# Altium project SmartDice-3rd.PrjPcb
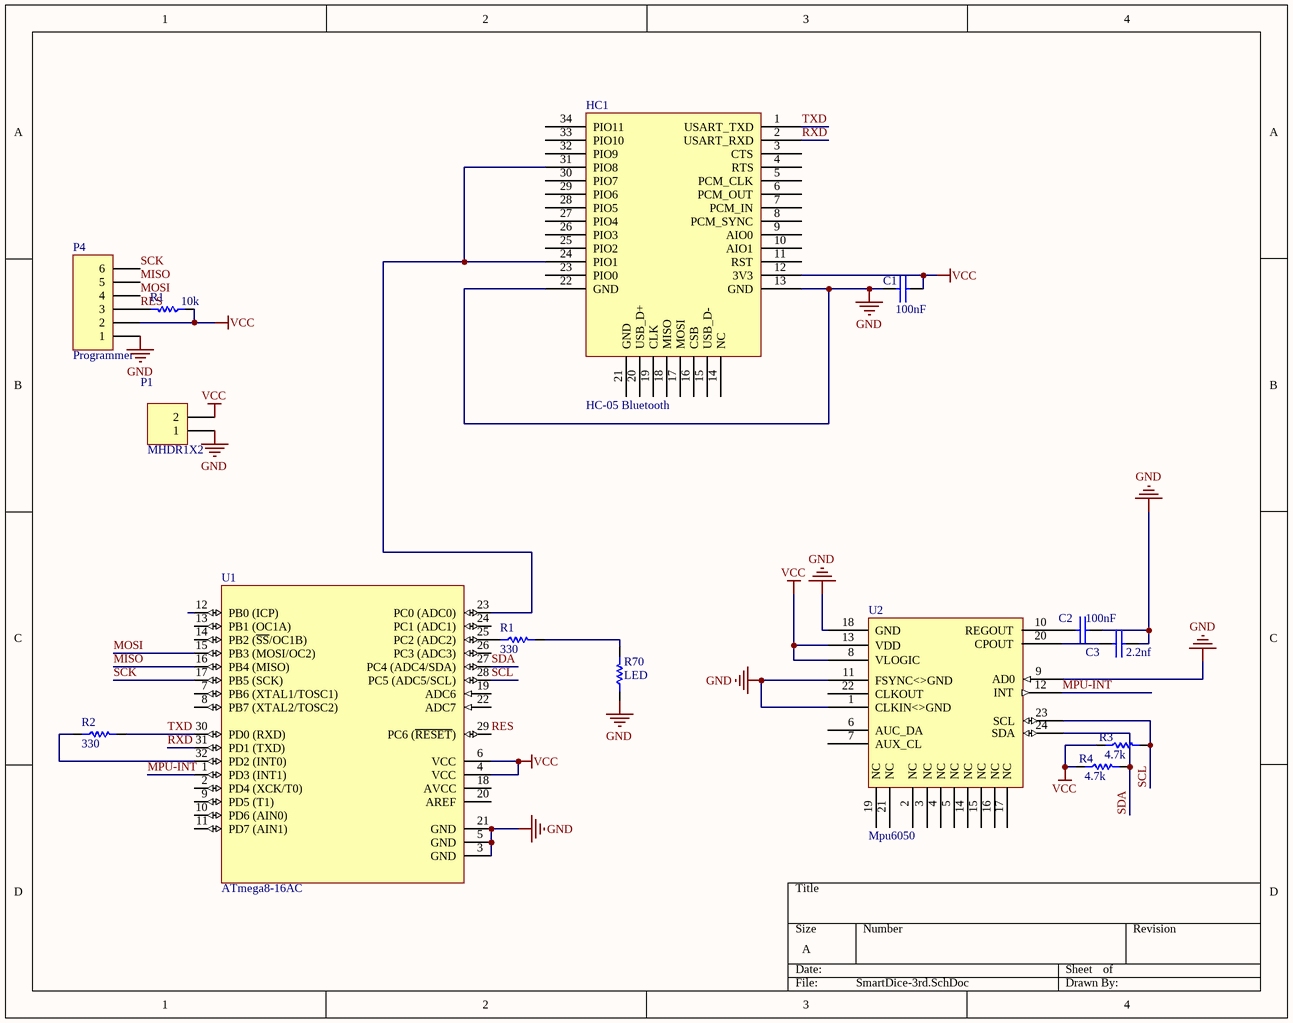
[diagram p0: SmartDice-3rd.SchDoc]
1 sheet, 14 parts. Net scope: global (net labels, ports and power ports of the same name join across sheets).
Board file: SmartDice-3rd.PcbDoc

## Sheet SmartDice-3rd.SchDoc
size A

### Parts
(Parts that share a designator on the sheet are numbered #1, #2 ... from top to bottom, then left to right.)
C1  100nF  [SMD_CAP_0805]
C2  100nF  [SMD_CAP_0805]
C3  2.2nf  [SMD_CAP_1206]
HC1  HC-05 Bluetooth  [HC-05]
P1  MHDR1X2  [MHDR1X2]
P4  Programmer  [MHDR1X6]
R1#1  10k  [RES 0603 (1608X06L)]
R1#2  330  [RES 0603 (1608X06L)]
R2  330  [RES 0603 (1608X06L)]
R3  4.7k  [RES 0603 (1608X06L)]
R4  4.7k  [RES 0603 (1608X06L)]
R70  LED  [RES 0603 (1608X06L)]
U1  ATmega8-16AC  [32A_N]
U2  Mpu6050  [Mpu6050]

### Nets
GND: C1.1(+) C2.2(-) C3.2(-) HC1.13(GND) HC1.22(GND) P1.1 P4.1 R70.1 U1.3(GND) U1.5(GND) U1.21(GND) U2.1(CLKIN<>GND) U2.9(AD0) U2.11(FSYNC<>GND) U2.18(GND)
VCC: C1.2(-) HC1.12(3V3) P1.2 P4.2 R1#1.1 R3.1 R4.1 U1.4(VCC) U1.6(VCC) U2.8(VLOGIC) U2.13(VDD)
MISO: P4.5 U1.16(PB4_(MISO))
MOSI: P4.4 U1.15(PB3_(MOSI/OC2))
MPU-INT: U1.1(PD3_(INT1)) U2.12(INT)
RES: P4.3 R1#1.2 U1.29(PC6_(~{RESET}))
RXD: HC1.2(USART_RXD) U1.31(PD1_(TXD))
SCK: P4.6 U1.17(PB5_(SCK))
SCL: R3.2 U1.28(PC5_(ADC5/SCL)) U2.23(SCL)
SDA: R4.2 U1.27(PC4_(ADC4/SDA)) U2.24(SDA)
TXD: HC1.1(USART_TXD) R2.2 U1.30(PD0_(RXD))
NetC2_1: C2.1(+) U2.10(REGOUT)
NetC3_1: C3.1(+) U2.20(CPOUT)
NetHC1_24: HC1.24(PIO1) HC1.31(PIO8) U1.23(PC0_(ADC0))
NetR1#2_1: R1#2.1 U1.25(PC2_(ADC2))
NetR1#2_2: R1#2.2 R70.2
NetR2_1: R2.1 U1.32(PD2_(INT0))

Not connected (* = marked no-connect by the designer): HC1 3(CTS) 4(RTS) 5(PCM_CLK) 6(PCM_OUT) 7(PCM_IN) 8(PCM_SYNC) 9(AIO0) 10(AIO1) 11(RST) 14(NC) 15(USB_D-) 16(CSB) 17(MOSI) 18(MISO) 19(CLK) 20(USB_D+) 21(GND) 23(PIO0) 25(PIO2) 26(PIO3) 27(PIO4) 28(PIO5) 29(PIO6) 30(PIO7) 32(PIO9) 33(PIO10) 34(PIO11); U1 2(PD4_(XCK/T0)) 7(PB6_(XTAL1/TOSC1)) 8(PB7_(XTAL2/TOSC2)) 9(PD5_(T1)) 10(PD6_(AIN0)) 11(PD7_(AIN1)) 12(PB0_(ICP)) 13(PB1_(OC1A)) 14(PB2_(~{SS}/OC1B)) 18(AVCC) 19(ADC6) 20(AREF) 22(ADC7) 24(PC1_(ADC1)) 26(PC3_(ADC3)); U2 2(NC) 3(NC) 4(NC) 5(NC) 6(AUC_DA) 7(AUX_CL) 14(NC) 15(NC) 16(NC) 17(NC) 19(NC) 21(NC) 22(CLKOUT)

### Library data of the parts
C1-C3 = Cap-Bipolar: Bipolar Capacitor; Voltage: 100V; Designer: Saeid Jorablo; Organazation: ControTec; Adding Date: 1387/12/20
  C1 C2: Value: 100nF
  C3: Value: 2.2nf
P1 = MHDR1X2: Header, 2-Pin; LatestRevisionDate: 17-Jul-2002; LatestRevisionNote: Re-released for DXP Platform.; Publisher: Altium Limited
P4 = MHDR1X6: Header, 6-Pin; LatestRevisionDate: 17-Jul-2002; LatestRevisionNote: Re-released for DXP Platform.; Publisher: Altium Limited
R1#1 R1#2 R2 R70 = Resistor
  R1#1: Value: 10k
  R1#2 R2: Value: 330
  R70: Value: LED
R3 R4 = Resistor: Tolerance: 5%; Power: 1/8 W; Value: 4.7k
U1 = ATmega8-16AC: 8-Bit AVR Microcontroller with 8K Bytes of In-System Programmable Flash Memory; Published: 17-Sep-2003; LatestRevisionDate: 13-Apr-2006; LatestRevisionNote: IPC-7351 Footprint Added.; DatasheetVersion: 2486H-AVR-09/02; PackageVersion: revB, Oct-2001; PackageReference: 32A; Publisher: Altium Limited; PackageDescription: 32-Pin Thin Quad Flat Pack 0.8 mm Pitch; Code_JEDEC: MS-026-ABA; ComponentLink1Description: Manufacturer Link; ComponentLink1URL: http://www.atmel.com; ComponentLink2Description: Datasheet; ComponentLink2URL: http://www.atmel.com/dyn/resources/prod_documents/doc2486.pdf
U2 = Mpu6050: Designer: Hamed Jafarzadeh - R2T - MashhadRobotic.ir